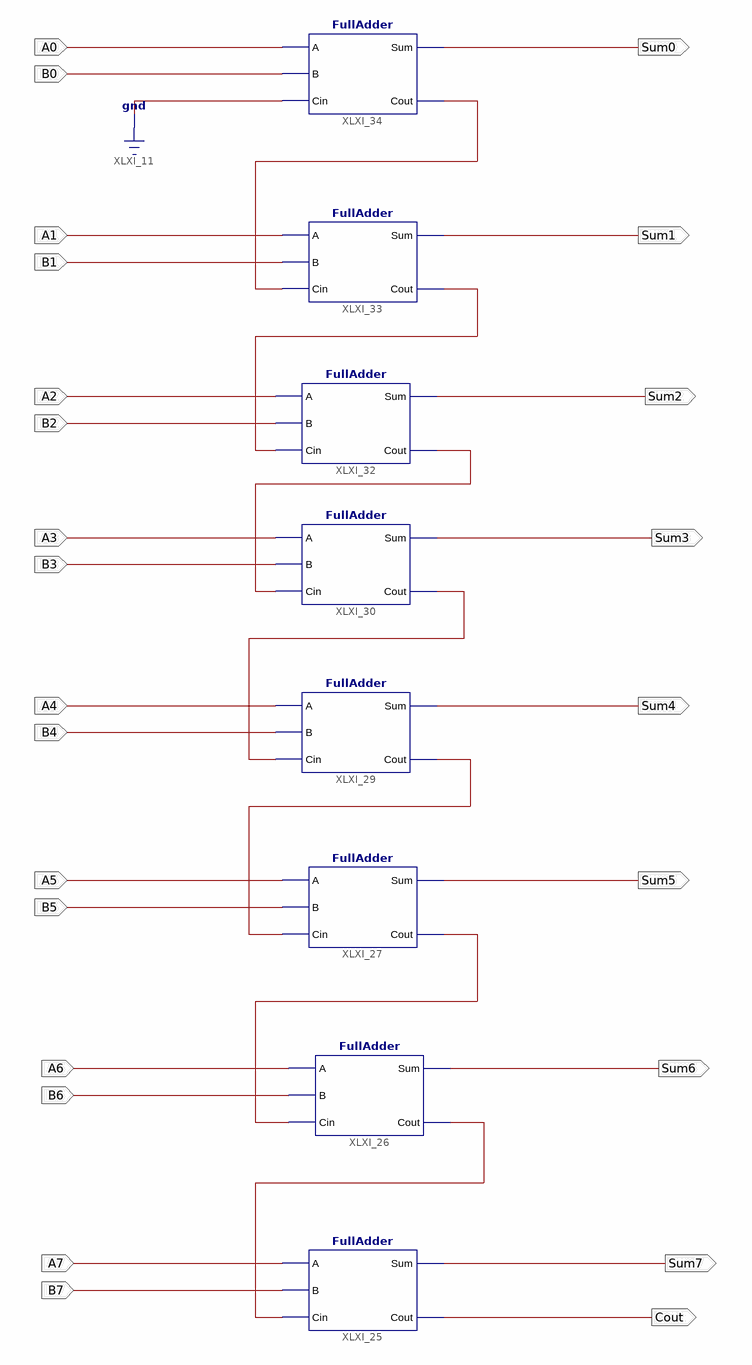
[diagram p0: schematic sheet 1]
// Xilinx ISE schematic adder8.sch (spartan6) as structural Verilog: 8 symbols, 25 ports
module adder8 (
  input  B6,
  input  A6,
  input  A7,
  input  B7,
  input  B5,
  input  A5,
  input  B4,
  input  A4,
  input  B3,
  input  A3,
  input  B2,
  input  A2,
  input  B1,
  input  A1,
  input  A0,
  input  B0,
  output Cout,
  output Sum7,
  output Sum5,
  output Sum6,
  output Sum4,
  output Sum3,
  output Sum2,
  output Sum1,
  output Sum0
);

  wire XLXN_7, XLXN_8, XLXN_9, XLXN_23, XLXN_27, XLXN_31, XLXN_147;

  FullAdder XLXI_25 (.A(A7), .B(B7), .Cin(XLXN_31), .Sum(Sum7), .Cout(Cout));
  FullAdder XLXI_26 (.A(A6), .B(B6), .Cin(XLXN_27), .Sum(Sum6), .Cout(XLXN_31));
  FullAdder XLXI_27 (.A(A5), .B(B5), .Cin(XLXN_23), .Sum(Sum5), .Cout(XLXN_27));
  FullAdder XLXI_29 (.A(A4), .B(B4), .Cin(XLXN_147), .Sum(Sum4), .Cout(XLXN_23));
  FullAdder XLXI_30 (.A(A3), .B(B3), .Cin(XLXN_9), .Sum(Sum3), .Cout(XLXN_147));
  FullAdder XLXI_32 (.A(A2), .B(B2), .Cin(XLXN_8), .Sum(Sum2), .Cout(XLXN_9));
  FullAdder XLXI_33 (.A(A1), .B(B1), .Cin(XLXN_7), .Sum(Sum1), .Cout(XLXN_8));
  FullAdder XLXI_34 (.A(A0), .B(B0), .Cin(1'b0), .Sum(Sum0), .Cout(XLXN_7));
endmodule
